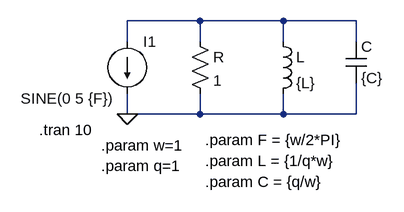
[diagram p0: schematic Circuito RLC en paralelo - FUENTE DE CORRIENTE.asc]
Circuito RLC en paralelo - FUENTE DE CORRIENTE.asc, the LTspice schematic file:
Version 4
SHEET 1 880 680
WIRE 112 96 0 96
WIRE 240 96 112 96
WIRE 352 96 240 96
WIRE 0 128 0 96
WIRE 112 128 112 96
WIRE 240 128 240 96
WIRE 352 128 352 96
WIRE 0 240 0 208
WIRE 112 240 112 208
WIRE 112 240 0 240
WIRE 240 240 240 208
WIRE 240 240 112 240
WIRE 352 240 352 192
WIRE 352 240 240 240
FLAG 0 240 0
SYMBOL res 96 112 R0
SYMATTR InstName R
SYMATTR Value 1
SYMBOL ind 224 112 R0
SYMATTR InstName L
SYMATTR Value {L}
SYMBOL cap 336 128 R0
SYMATTR InstName C
SYMATTR Value {C}
SYMBOL current 0 128 R0
WINDOW 3 -164 88 Left 2
SYMATTR InstName I1
SYMATTR Value SINE(0 5 {F})
TEXT -40 288 Left 2 !.param w=1
TEXT 120 280 Left 2 !.param F = {w/2*PI}
TEXT -40 320 Left 2 !.param q=1
TEXT 120 312 Left 2 !.param L = {1/q*w}
TEXT -136 264 Left 2 !.tran 10
TEXT 120 344 Left 2 !.param C = {q/w}

The netlist it stands for:
* Circuito RLC en paralelo - FUENTE DE CORRIENTE.asc
R N001 0 1
L N001 0 {L}
C N001 0 {C}
I1 N001 0 SINE(0 5 {F})
.param w=1
.param F = {w/2*PI}
.param q=1
.param L = {1/q*w}
.tran 10
.param C = {q/w}
.backanno
.end